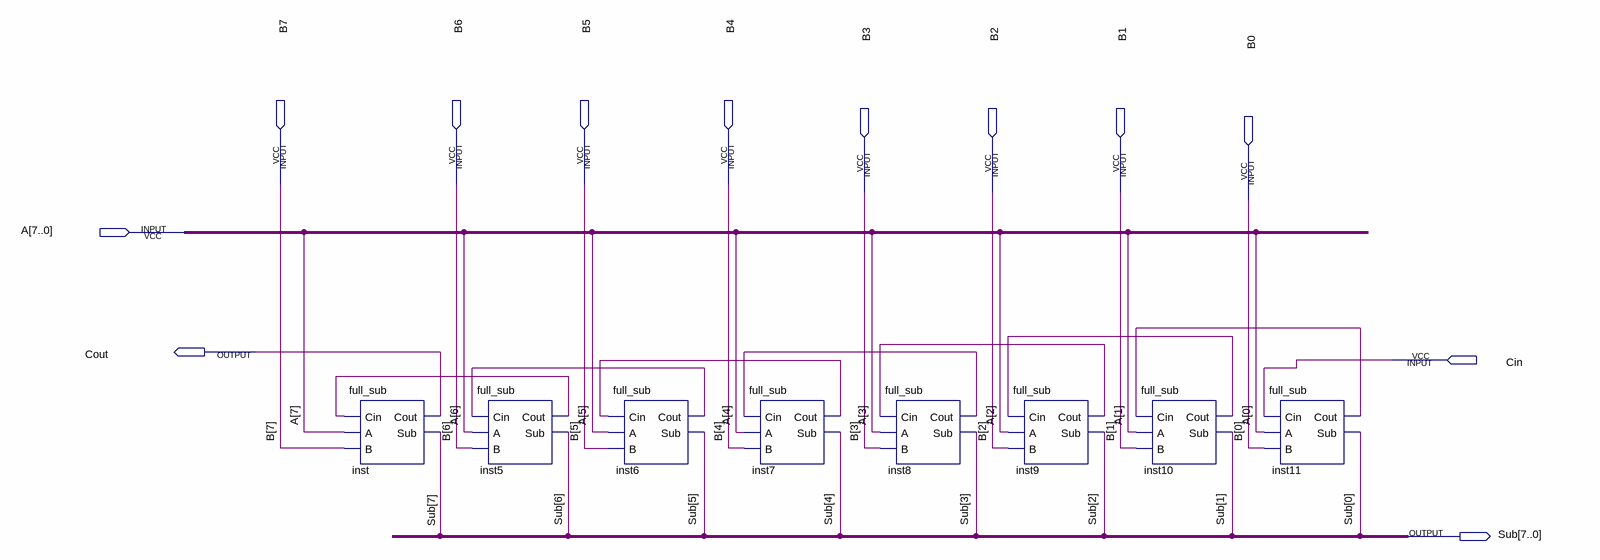
[diagram p0: schematic sheet]
// Quartus schematic full_sub_1.bdf as structural Verilog: 8 symbols, 12 pins
module full_sub_1 (
  input  B7,
  input  B6,
  input  B5,
  input  B4,
  input  B3,
  input  B2,
  input  B1,
  input  B0,
  input  [7:0] A,
  input  Cin,
  output Cout,
  output [7:0] Sub
);

  wire inst5_cout, inst6_cout, inst7_cout, inst8_cout, inst9_cout, inst10_cout, inst11_cout;

  full_sub inst (.Cin(inst5_cout), .A(A[7]), .B(B7), .Cout(Cout), .Sub(Sub[7]));
  full_sub inst5 (.Cin(inst6_cout), .A(A[6]), .B(B6), .Cout(inst5_cout), .Sub(Sub[6]));
  full_sub inst6 (.Cin(inst7_cout), .A(A[5]), .B(B5), .Cout(inst6_cout), .Sub(Sub[5]));
  full_sub inst7 (.Cin(inst8_cout), .A(A[4]), .B(B4), .Cout(inst7_cout), .Sub(Sub[4]));
  full_sub inst8 (.Cin(inst9_cout), .A(A[3]), .B(B3), .Cout(inst8_cout), .Sub(Sub[3]));
  full_sub inst9 (.Cin(inst10_cout), .A(A[2]), .B(B2), .Cout(inst9_cout), .Sub(Sub[2]));
  full_sub inst10 (.Cin(inst11_cout), .A(A[1]), .B(B1), .Cout(inst10_cout), .Sub(Sub[1]));
  full_sub inst11 (.Cin(Cin), .A(A[0]), .B(B0), .Cout(inst11_cout), .Sub(Sub[0]));
endmodule
